# Altium schematic sheet USB_C_PD_Sink.SchDoc
size A4; Engineer: IBRAR AHMAD
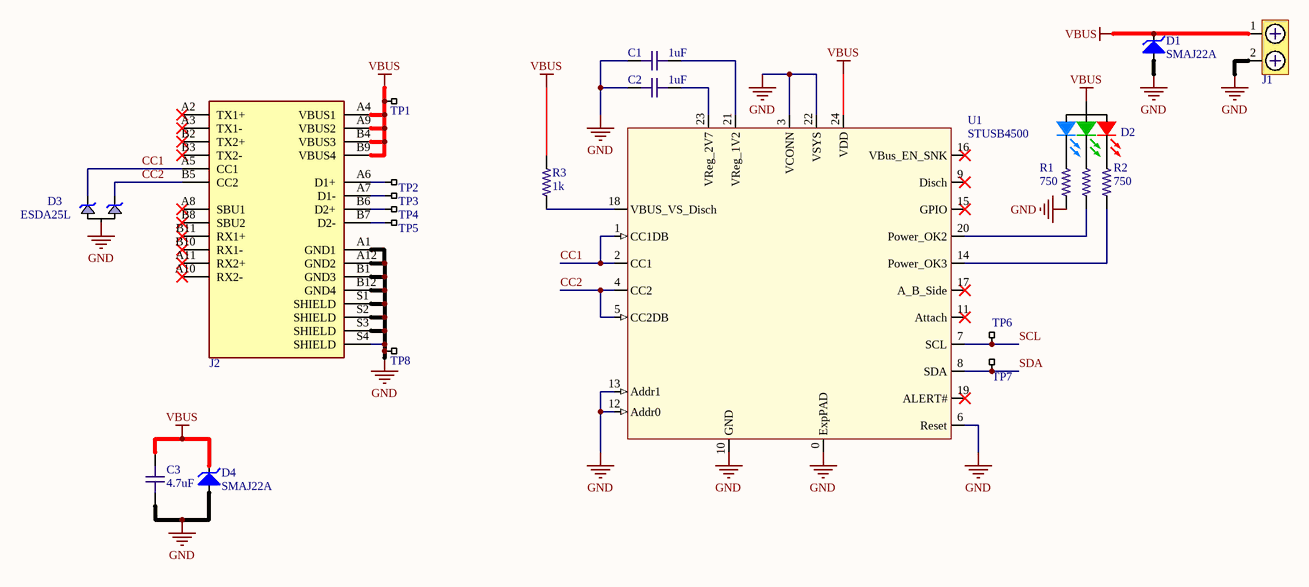
[diagram p0: USB_C_PD_Sink.SchDoc]

## Parts
C1  value 1uF  [C0603-IPC]  (hidden comment: C0603 1uF 10V X7R)
C2  value 1uF  [C0603-IPC]  (hidden comment: C0603 1uF 10V X7R)
C3  value 4.7uF  [C0603-HIGH-DENSITY]  (hidden comment: 4.7uF, 25V, X5R, 0603)
D1  SMAJ22A  [DO-214AC]
D2  RGB  [LED_0606_RGB_WURTH]  (value not drawn)
D3  ESDA25L  [SOT23-3L]
D4  SMAJ22A  [DO-214AC]
J1  Phoenix Contact 1935161  [Phoenix_1935161]  (value not drawn)
J2  USB C  [Molex USB-C]  (value not drawn)
R1  value 750  [R0805-High-Density]  (hidden comment: R0805 750 5%)
R2  value 750  [R0805-High-Density]  (hidden comment: R0805 750 5%)
R3  value 1k  [R0603-HIGH-DENSITY]  (hidden comment: R0603 1K 1%)
R4  R0805 750 5%  [R0805-High-Density]  (value not drawn)
TP1  VBUS  [TESTPOINT_SMT]  (value not drawn)  (no BOM)
TP2  D1+  [TESTPOINT_SMT]  (value not drawn)  (no BOM)
TP3  D1-  [TESTPOINT_SMT]  (value not drawn)  (no BOM)
TP4  D2+  [TESTPOINT_SMT]  (value not drawn)  (no BOM)
TP5  D2-  [TESTPOINT_SMT]  (value not drawn)  (no BOM)
TP6  SCL  [TESTPOINT_SMT]  (value not drawn)  (no BOM)
TP7  SDA  [TESTPOINT_SMT]  (value not drawn)  (no BOM)
TP8  VBUS  [TESTPOINT_SMT]  (value not drawn)  (no BOM)
U1  STUSB4500  [QFN24 - 4X4MM - PITCH 0.5MM - EXPOSEDPAD]

## Nets
GND: C1.1 C2.1 C3.1 D1.1(A) D3.3(A) D4.1(A) J1.2 J2.A1(GND1) J2.A12(GND2) J2.B1(GND3) J2.B12(GND4) J2.S1(SHIELD) J2.S2(SHIELD) J2.S3(SHIELD) J2.S4(SHIELD) R1.1 TP8.1 U1.0(ExpPAD) U1.3(VCONN) U1.6(Reset) U1.10(GND) U1.12(Addr0) U1.13(Addr1) U1.22(VSYS)
VBUS: C3.2 D1.2(K) D2.A D4.2(K) J1.1 J2.A4(VBUS1) J2.A9(VBUS2) J2.B4(VBUS3) J2.B9(VBUS4) R3.2 TP1.1 U1.24(VDD)
CC1: D3.2(K2) J2.A5(CC1) U1.1(CC1DB) U1.2(CC1)
CC2: D3.1(K1) J2.B5(CC2) U1.4(CC2) U1.5(CC2DB)
SCL: TP6.1 U1.7(SCL)
SDA: TP7.1 U1.8(SDA)
NetC1_2: C1.2 U1.21(VReg_1V2)
NetC2_2: C2.2 U1.23(VReg_2V7)
NetD2_BK: D2.BK R1.2
NetD2_GK: D2.GK R4.2
NetD2_RK: D2.RK R2.2
NetJ2_A6: J2.A6(D1+) TP2.1
NetJ2_A7: J2.A7(D1-) TP3.1
NetJ2_B6: J2.B6(D2+) TP4.1
NetJ2_B7: J2.B7(D2-) TP5.1
NetR2_1: R2.1 U1.14(Power_OK3)
NetR3_1: R3.1 U1.18(VBUS_VS_Disch)
NetR4_1: R4.1 U1.20(Power_OK2)

Not connected (* = marked no-connect by the designer): J2 A2(TX1+)* A3(TX1-)* A8(SBU1)* A10(RX2-)* A11(RX2+)* B2(TX2+)* B3(TX2-)* B8(SBU2)* B10(RX1-)* B11(RX1+)*; U1 9(Disch)* 11(Attach)* 15(GPIO)* 16(VBus_EN_SNK)* 17(A_B_Side)* 19(ALERT#)*

## Library data of the parts
C1 C2 = C0603 1uF 10V X7R: Chip Capacitor, 0603, 1uF +/- 0.1uF, 10V, X7R; Supplier 1: Digi-Key; Supplier Part Number 1: 1276-1946-1-ND; Max. Voltage: 10V; EIA Code: X7R
C3 = C0603 4.7uF 25V X5R: Chip Capacitor, 0603, 4.7uF, 25V, X5R; EIA Code: X5R; Max. Voltage: 25V; Supplier 1: Digi-Key; Supplier 2: Mouser; Supplier 3: LCSC; Supplier Part Number 1: 490-7203-1-ND; Supplier Part Number 2: 81-GRM188R61E475KE1D; Supplier Part Number 3: C90057
D1 D4 = SMAJ22A: Bidirectional TVS DIODE 22V 35.5V DO214AC; Manufacturer: Littlefuse Inc.; Value: 24.4V; Manufacturer’s ordering code: SMAJ22A; Part Number: SMAJ22A; Supplier 1: Digi-Key; Supplier 2: Mouser; Supplier 3: LCSC; Supplier Part Number 1: SMAJ22ALFCT-ND; Supplier Part Number 2: 576-SMAJ22A; Supplier Part Number 3: C148220
D2 = Led_RGB_0606: RGB Led 1.6 x 1.6 mm Diffused; Manufacturer: Everlight; Manufacturer Part Number: 19-237/R6GHBHW-C01/2T; Supplier 1: Digi-Key; Supplier Part Number 1: 1080-1590-1-ND
D3 = ESDA25L: Dual Transil Array For ESD Protection in SOT23-3 Vbr = 25V; Manufacturer: STMicroelectronics; Supplier 1: Digi-Key; Supplier 2: Mouser; Supplier 3: LCSC; Supplier Part Number 1: 497-4642-1-ND; Supplier Part Number 2: 511-ESDA25L; Supplier Part Number 3: C95343; Manufacturer Part Number: ESDA25L
J1 = Term Block 2pos: Terminal Block, 2 Position, 5mm pitch, 18A, 300V, 12-26 AWG; Manufacturer: Phoenix Contact; Manufacturer Part Number: 1935161; Supplier 1: Digi-Key; Supplier Part Number 1: 277-1667-ND
J2 = USB C: USB-C USB 3.1 Gen 2, Superspeed+_ Receptacle Connector 24 Position Surface Mount, Right Angle; Through Hole; MF: Molex; MP: 1054500101; Package: None; Digi-Key_Part_Number: WM12856CT-ND; SnapEDA_Link: https://www.snapeda.com/parts/1054500101/Molex/view-part/448528/?ref=snap; Digi-Key_Purchase_URL: https://www.digikey.tw/product-detail/en/molex/1054500101/WM12856CT-ND/5843891?utm_source=snapeda&utm_medium=aggregator&utm_campaign=symbol; Value: *; Supplier 1: Digi-Key; Supplier 2: Mouser; Supplier 3: LCSC; Supplier Part Number 1: WM12856CT-ND; Supplier Part Number 2: 538-105450-0101; Supplier Part Number 3: C134092
R1 R2 = R0603 750 1%: Chip Resistor, 0603, 750 ohms, 0.5W; Supplier 1: Digi-Key; Supplier Part Number 1: P750ADCT-ND; Supplier 2: Mouser; Supplier Part Number 2: 667-ERJ-P06J751V; Supplier 3: LCSC; Supplier Part Number 3: C441948
R3 = R0603 1K 1%: RES SMD 1K OHM 1% 1/10W 0603; Temperature Coefficient: ±100ppm/°C; Operating Temperature: -55°C ~ 155°C; Features: Automotive AEC-Q200; Tolerance: ±1%; Supplier 1: Digi-Key; Supplier Part Number 1: RMCF0603FG1K00CT-ND
R4 = R0603 750 1%: Chip Resistor, 0603, 750 ohms, 0.5W; Value: 750; Supplier 1: Digi-Key; Supplier Part Number 1: P750ADCT-ND; Supplier 2: Mouser; Supplier Part Number 2: 667-ERJ-P06J751V; Supplier 3: LCSC; Supplier Part Number 3: C441948
TP1-TP8 = Testpoint_SMT: SMT Test Point
U1 = STUSB4500QTR: Standalone USB PD controller  with SINK auto-run mode in QFN24 4x4mm; Manufacturer: STMicroelectronics; Part Number: Standalone USB PD controller  with SINK auto-run mode in QFN24 4x4mm; Manufacturer’s ordering code: STUSB4500QTR; Value: STUSB4500; Supplier 1: Digi-Key; Supplier 2: Mouser; Supplier Part Number 1: 497-18060-1-ND; Supplier Part Number 2: 511-STUSB4500QTR